# EAGLE design Capstone_Shield (EAGLE 9.6.2)
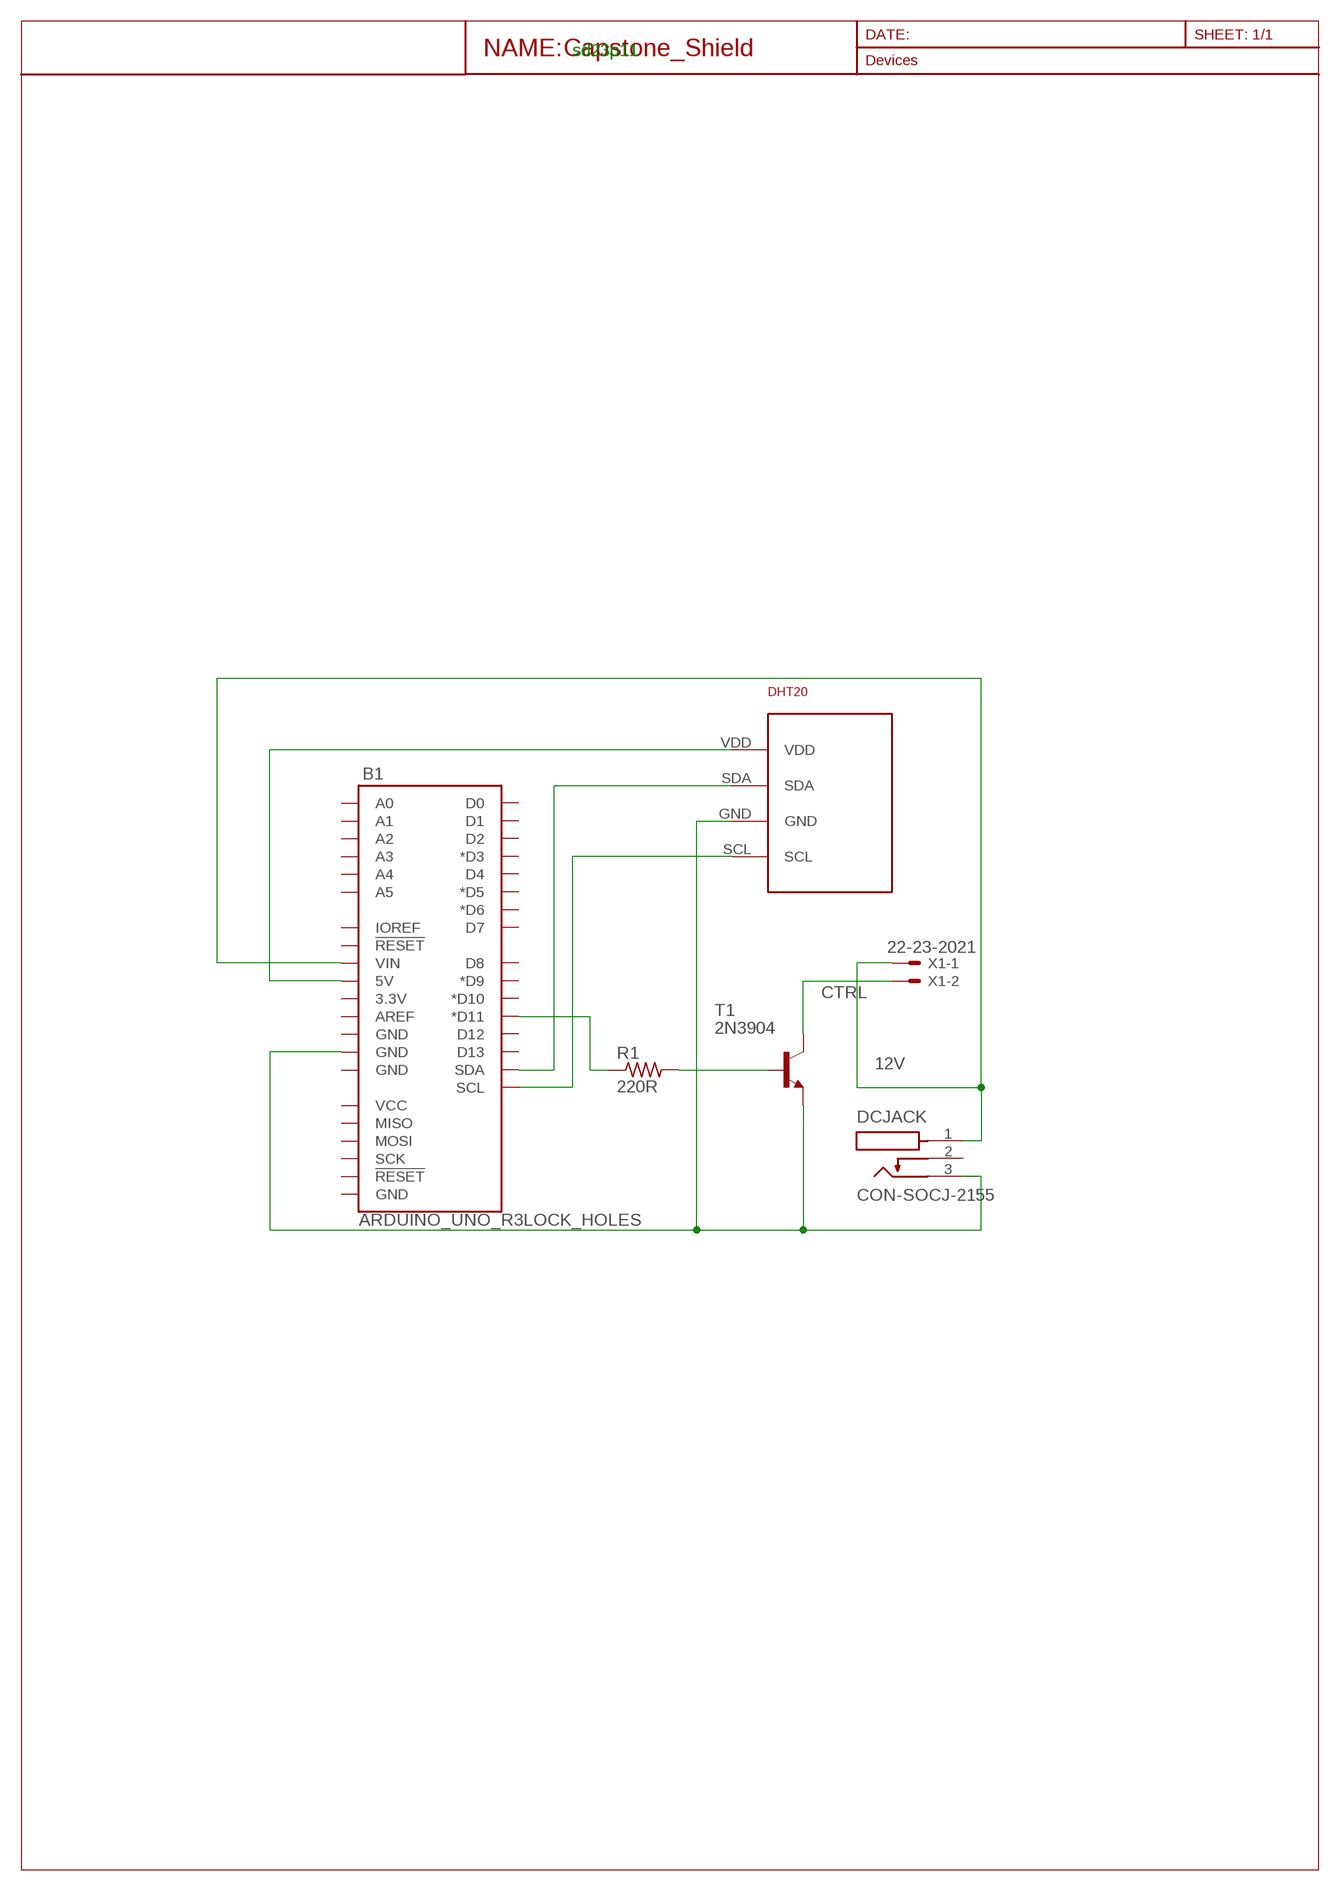
[diagram p0: schematic, sheet 1]

## Parts
B1  ARDUINO_UNO_R3LOCK_HOLES  [ARDUINO_R3_LOCK_HOLES]
DCJACK  CON-SOCJ-2155  [GRAVITECH_CON-SOCJ-2155]
R1  220R  R-US_0207/10  [0207/10]
T1  2N3904  [TO92]
U$1  DHT20THROUGH_HOLE  [DHT20]
X1  22-23-2021  [22-23-2021]

## Nets
12V: B1.VIN DCJACK.1 X1.1
CTRL: T1.1(C) X1.2
N$1: B1.5V U$1.VDD
N$2: B1.SDA U$1.SDA
N$3: B1.D11(*D11) R1.1
N$4: R1.2 T1.2(B)
N$5: B1.GND@3(GND) DCJACK.3 T1.3(E) U$1.GND
N$6: B1.SCL U$1.SCL
Unconnected: B1.3.3V B1.A0 B1.A1 B1.A2 B1.A3 B1.A4 B1.A5 B1.AREF B1.D0 B1.D1 B1.D2 B1.D3(*D3) B1.D4 B1.D5(*D5) B1.D6(*D6) B1.D7 B1.D8 B1.D9(*D9) B1.D10(*D10) B1.D12 B1.D13 B1.GND@1(GND) B1.GND@2(GND) B1.GND@4(GND) B1.IOREF B1.MISO B1.MOSI B1.RESET@1(!RESET!) B1.RESET@2(!RESET!) B1.SCK B1.VCC DCJACK.2

## Notes on the sheet
- sd23p11

## Library data of the parts
B1 = SparkFun-Boards:ARDUINO_UNO_R3: Arduino R3 Footprint with SPI header Arduino Uno R3 Compatible Footprint. Matches PCB size of the original board. SparkFun Products: SAMD21 Dev Breakout <https://www.sparkfun.com/products/13672> RedBoard <https://www.sparkfun.com/products/12757> R3 Stackable Headers <https://www.sparkfun.com/products/11417>
DCJACK = CON-SOCJ-2155:CON-SOCJ-2155: DC Power Connectors Power Jack/Connector 2.1mm x 5.5mm Check availability <https://pricing.snapeda.com/parts/CON-SOCJ-2155/Gravitech/view-part?ref=eda>; AVAILABILITY: In Stock; DESCRIPTION: DC Power Connectors Power Jack/Connector 2.1mm x 5.5mm; MF: Gravitech; MP: CON-SOCJ-2155; PACKAGE: None; PRICE: None; PURCHASE-URL: https://pricing.snapeda.com/search/part/CON-SOCJ-2155/?ref=eda
R1 = rcl:R-US_: RESISTOR, American symbol; SPICEPREFIX: R
T1 = transistor:2N3904: NPN TRANSISTOR
U$1 = DHT20:DHT20
X1 = con-molex:22-23-2021: .100" (2.54mm) Center Header - 2 Pin; MF: MOLEX; MPN: FAN; OC_FARNELL: 1462926; OC_NEWARK: 25C3832

## Board
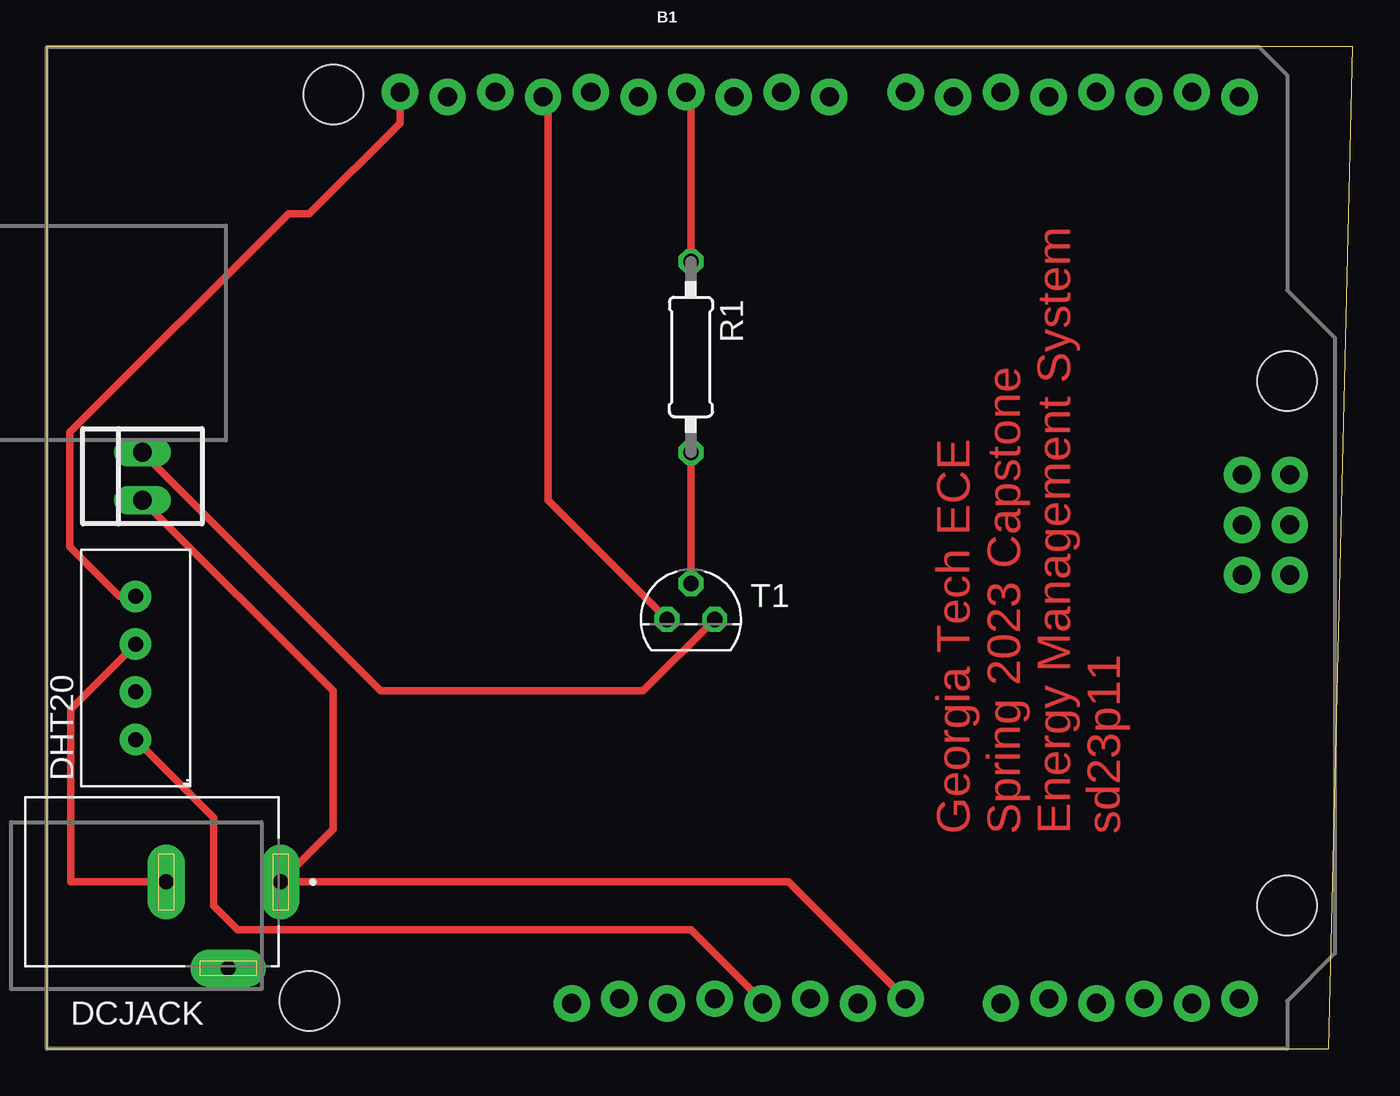
[diagram p1: board, top side]
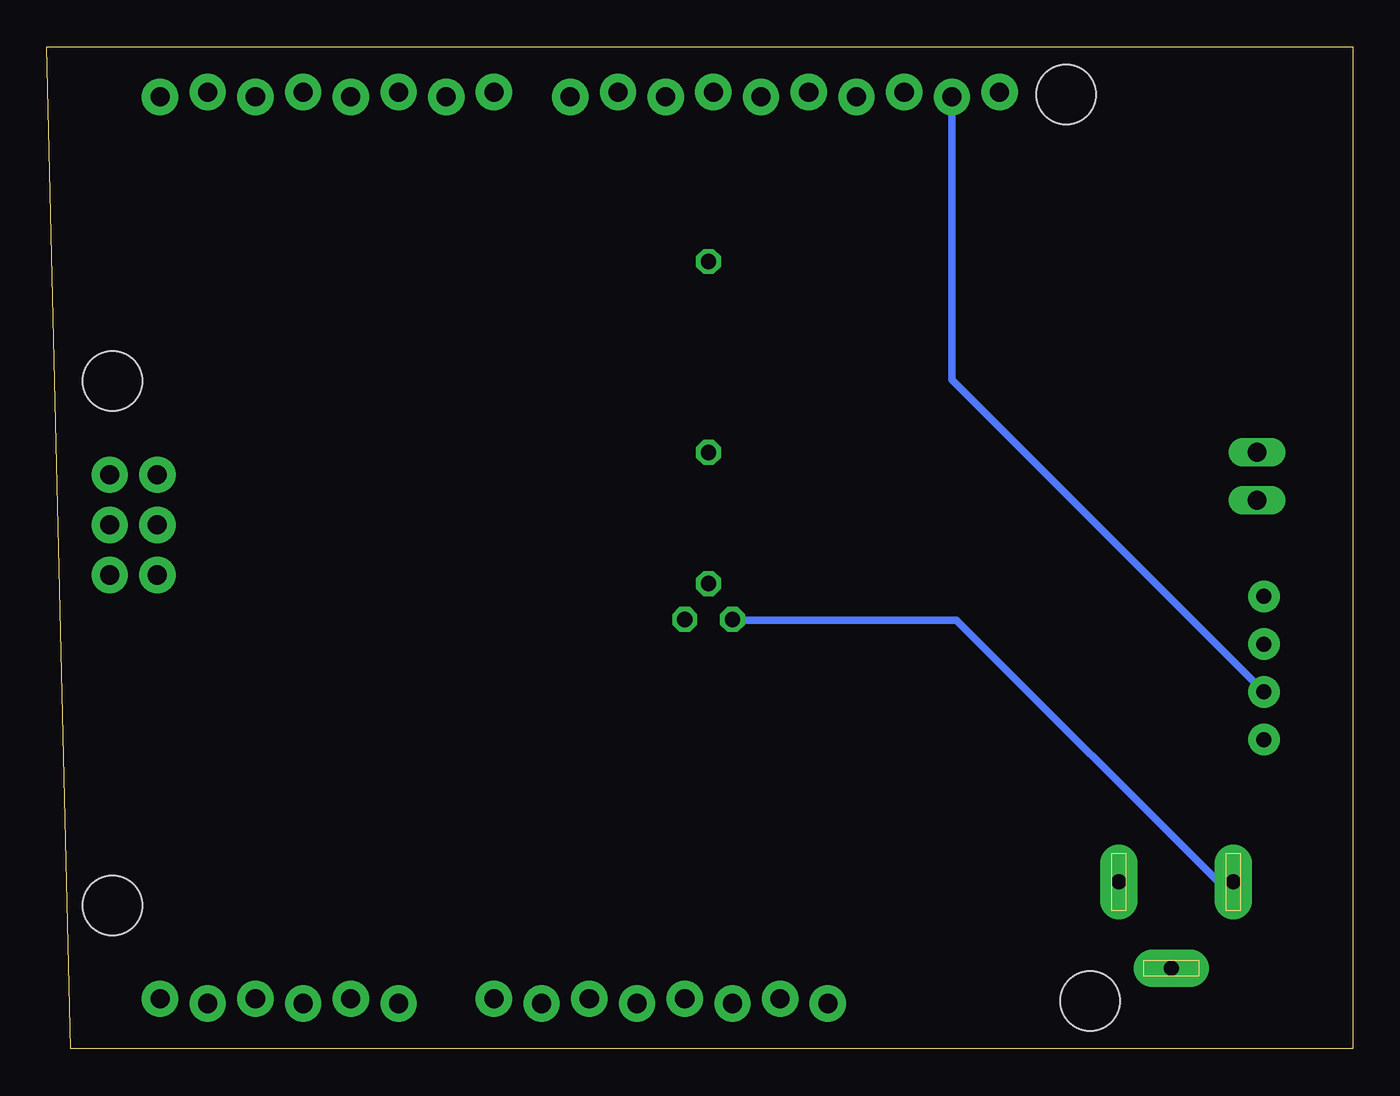
[diagram p2: board, bottom side, seen from below]

Size 69.52 x 53.33 mm. Coordinates in mm from the lower left corner, seen from the top.
Outline: 0,0 68.25,0 69.52,53.33 0,53.33 0,0
Copper layers (1*16): Top 0.035mm / dielectric 1.5mm / Bottom 0.035mm
Design rules "default *": minimum track width 6mil, minimum drill 0.35mm, track to track 6mil, track to pad 6mil, pad to pad 6mil, via to via 6mil, smd to smd 6mil, copper to edge 40mil, drill to drill 6mil, minimum pad ring 10mil, minimum via ring 8mil, stop-mask expansion 4mil, vias tented up to drill 0mil, thermal gap 10mil

### Footprints (pad centres in the part's own frame; a part is rotated, then mirrored left to right if it is on the bottom)
ARDUINO_R3_LOCK_HOLES = drill 1.016 pad 1.93: 3.3V 35.56,2.667; 5V 38.1,2.413; A0 50.8,2.413; A1 53.34,2.667; A2 55.88,2.413; A3 58.42,2.667; A4 60.96,2.413; A5 63.5,2.667; AREF 23.876,50.927; D0 63.5,50.673; D1 60.96,50.927; D2 58.42,50.673; D3 55.88,50.927; D4 53.34,50.673; D5 50.8,50.927; D6 48.26,50.673; D7 45.72,50.927; D8 41.656,50.673; D9 39.116,50.927; D10 36.576,50.673; D11 34.036,50.927; D12 31.496,50.673; D13 28.956,50.927; GND@1 40.64,2.667; GND@2 43.18,2.413; GND@3 26.416,50.673; GND@4 66.18,25.223; IOREF 30.48,2.667; MISO 63.64,30.557; MOSI 66.18,27.89; NC 27.94,2.413; RESET@1 33.02,2.413; RESET@2 63.64,25.223; SCK 63.64,27.89; SCL 18.796,50.927; SDA 21.336,50.673; VCC 66.18,30.557; VIN 45.72,2.667 | hole 3.175: 15.24,50.8; 66.04,35.56; 66.04,7.62; 13.97,2.54
GRAVITECH_CON-SOCJ-2155 = drill 0.8 pad 2 long: 1 6.1,0; 2 3.3,-4.6; 3 0,0
0207/10 = drill 0.813 octagon: 1 -5.08,0; 2 5.08,0
TO92 = drill 0.813 octagon: 1 1.27,0; 2 0,1.905; 3 -1.27,0
DHT20 = drill 0.8 pad 1.676: GND 7.57,2.9; SCL 10.11,2.9; SDA 5.03,2.9; VDD 2.49,2.9
22-23-2021 = drill 1 long: 1 -1.27,0; 2 1.27,0

### Placement (x,y rotation side)
B1  0,0 0 top
DCJACK  6.35,8.89 0 top
R1  34.29,36.83 270 top
T1  34.29,22.86 0 top
U$1  7.62,13.97 90 top
X1  5.08,30.48 90 top

### Tracks (layer width: path | path; a pad name or v marks a point on that pad's centre or on a via)
12V
  Top 0.406: X1.1 15.24,19.05 15.24,11.68 DCJACK.1 39.5,8.89 B1.VIN
CTRL
  Top 0.406: T1.1 31.75,19.05 17.78,19.05 X1.2
N$1
  Top 0.152: 38.1,2.54 B1.5V
  Top 0.406: 38.1,2.54 34.29,6.35 10.16,6.35 8.89,7.62 8.89,12.29 U$1.VDD
N$2
  Bottom 0.406: U$1.SDA 21.34,35.62 B1.SDA
N$3
  Top 0.406: B1.D11 34.29,50.67 R1.1
N$4
  Top 0.406: R1.2 T1.2
N$5
  Top 0.406: B1.GND@3 26.67,50.42 26.67,29.21 T1.3 | DCJACK.3 1.27,8.89 1.27,18.09 U$1.GND
  Bottom 0.152: 6.76,8.48 DCJACK.3 | 32.92,22.81 T1.3
  Bottom 0.406: 6.76,8.48 21.08,22.81 32.92,22.81
N$6
  Top 0.406: U$1.SCL 3.86,24.08 1.22,26.72 1.22,32.81 12.86,44.45 13.97,44.45 18.8,49.28 B1.SCL

### Text on the board
Top: Georgia Tech ECE / Spring 2023 Capstone / Energy Management System / sd23p11